# Altium schematic sheet LAUNCHXL-F28379D_5.SchDoc
size 301 x 239 mm
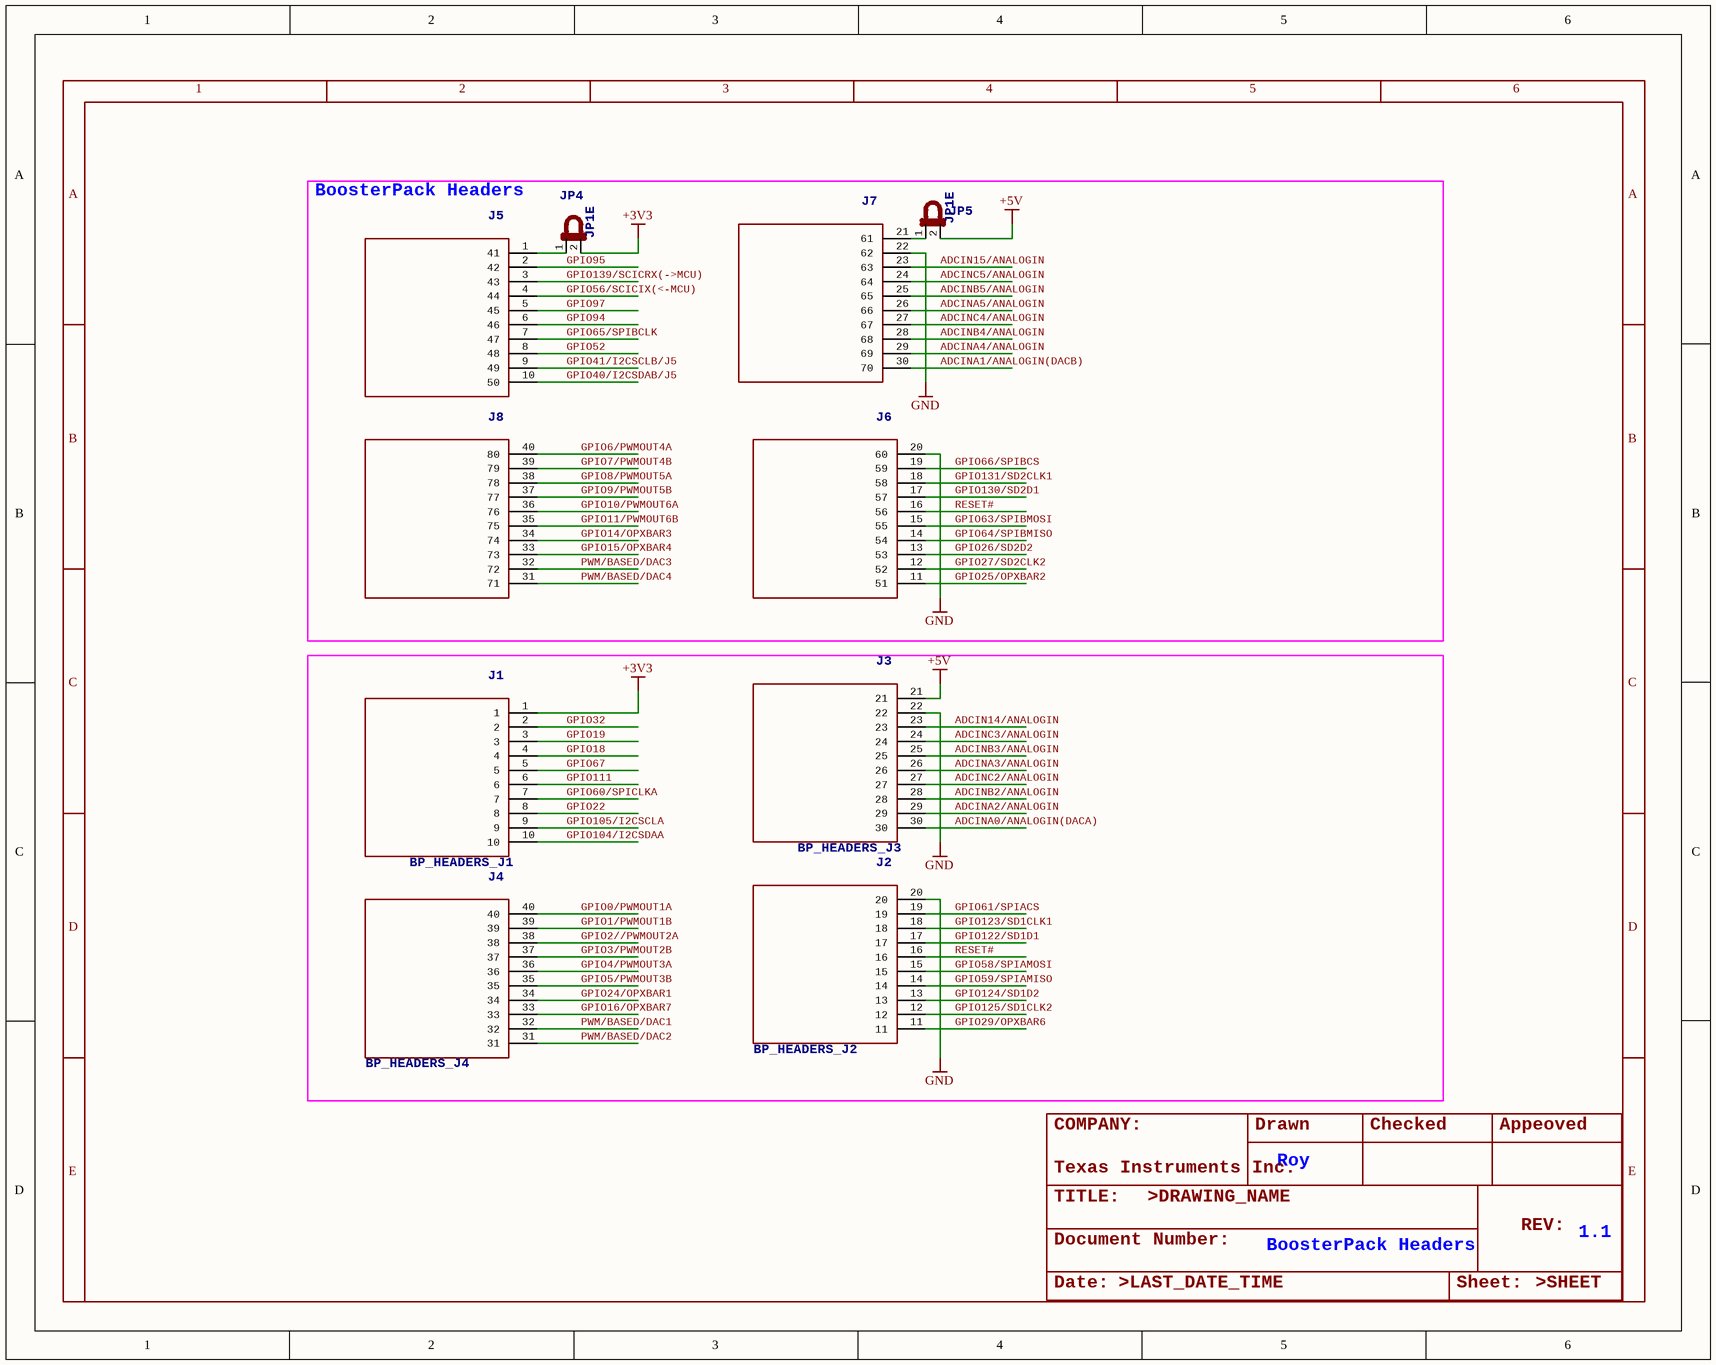
[diagram p0: LAUNCHXL-F28379D_5.SchDoc]

## Parts
J1  BP_HEADERS_J1  [J1]
J2  BP_HEADERS_J2  [J2]
J3  BP_HEADERS_J3  [J3]
J4  BP_HEADERS_J4  [J4]
J5  LAUNCHPAD_TEMPLATE_LIBRARY_BP_HEADERS_J5  [LAUNCHPAD_TEMPLATE_LIBRARY_J5]  (value not drawn)
J6  LAUNCHPAD_TEMPLATE_LIBRARY_BP_HEADERS_J6  [LAUNCHPAD_TEMPLATE_LIBRARY_J6]  (value not drawn)
J7  LAUNCHPAD_TEMPLATE_LIBRARY_BP_HEADERS_J7  [LAUNCHPAD_TEMPLATE_LIBRARY_J7]  (value not drawn)
J8  LAUNCHPAD_TEMPLATE_LIBRARY_BP_HEADERS_J8  [LAUNCHPAD_TEMPLATE_LIBRARY_J8]  (value not drawn)
JP4  JP1E  [JP1]
JP5  JP1E  [JP1]
U$12  ROY_JUMPER  [ROY_JUMPER]  (value not drawn)
U$13  ROY_JUMPER  [ROY_JUMPER]  (value not drawn)

## Blocks framed on the sheet
BoosterPack Headers: J5-J8 JP4 JP5 U$12 U$13

## Nets
+3V3: J1.1 JP4.2
+5V: J3.21 JP5.2
GND: J2.20 J3.22 J6.20(60) J7.22(62)
ADCIN14/ANALOGIN: J3.23
ADCIN15/ANALOGIN: J7.23(63)
ADCINA0/ANALOGIN(DACA): J3.30
ADCINA1/ANALOGIN(DACB): J7.30(70)
ADCINA2/ANALOGIN: J3.29
ADCINA3/ANALOGIN: J3.26
ADCINA4/ANALOGIN: J7.29(69)
ADCINA5/ANALOGIN: J7.26(66)
ADCINB2/ANALOGIN: J3.28
ADCINB3/ANALOGIN: J3.25
ADCINB4/ANALOGIN: J7.28(68)
ADCINB5/ANALOGIN: J7.25(65)
ADCINC2/ANALOGIN: J3.27
ADCINC3/ANALOGIN: J3.24
ADCINC4/ANALOGIN: J7.27(67)
ADCINC5/ANALOGIN: J7.24(64)
GPIO0/PWMOUT1A: J4.40
GPIO1/PWMOUT1B: J4.39
GPIO2//PWMOUT2A: J4.38
GPIO3/PWMOUT2B: J4.37
GPIO4/PWMOUT3A: J4.36
GPIO5/PWMOUT3B: J4.35
GPIO6/PWMOUT4A: J8.40(80)
GPIO7/PWMOUT4B: J8.39(79)
GPIO8/PWMOUT5A: J8.38(78)
GPIO9/PWMOUT5B: J8.37(77)
GPIO10/PWMOUT6A: J8.36(76)
GPIO11/PWMOUT6B: J8.35(75)
GPIO14/OPXBAR3: J8.34(74)
GPIO15/OPXBAR4: J8.33(73)
GPIO16/OPXBAR7: J4.33
GPIO18: J1.4
GPIO19: J1.3
GPIO22: J1.8
GPIO24/OPXBAR1: J4.34
GPIO25/OPXBAR2: J6.11(51)
GPIO26/SD2D2: J6.13(53)
GPIO27/SD2CLK2: J6.12(52)
GPIO29/OPXBAR6: J2.11
GPIO32: J1.2
GPIO40/I2CSDAB/J5: J5.10(50)
GPIO41/I2CSCLB/J5: J5.9(49)
GPIO52: J5.8(48)
GPIO56/SCICIX(<-MCU): J5.4(44)
GPIO58/SPIAMOSI: J2.15
GPIO59/SPIAMISO: J2.14
GPIO60/SPICLKA: J1.7
GPIO61/SPIACS: J2.19
GPIO63/SPIBMOSI: J6.15(55)
GPIO64/SPIBMISO: J6.14(54)
GPIO65/SPIBCLK: J5.7(47)
GPIO66/SPIBCS: J6.19(59)
GPIO67: J1.5
GPIO94: J5.6(46)
GPIO95: J5.2(42)
GPIO97: J5.5(45)
GPIO104/I2CSDAA: J1.10
GPIO105/I2CSCLA: J1.9
GPIO111: J1.6
GPIO122/SD1D1: J2.17
GPIO123/SD1CLK1: J2.18
GPIO124/SD1D2: J2.13
GPIO125/SD1CLK2: J2.12
GPIO130/SD2D1: J6.17(57)
GPIO131/SD2CLK1: J6.18(58)
GPIO139/SCICRX(->MCU): J5.3(43)
PWM/BASED/DAC1: J4.32
PWM/BASED/DAC2: J4.31
PWM/BASED/DAC3: J8.32(72)
PWM/BASED/DAC4: J8.31(71)
RESET#: J2.16 J6.16(56)
NetJ5_1: J5.1(41) JP4.1
NetJ7_21: J7.21(61) JP5.1

## Notes on the sheet
- COMPANY:
- Texas
  Instruments Inc.
- Drawn
- Roy
- Checked
- Appeoved
- TITLE:
- Document Number:
- >DRAWING_NAME
- REV:
- 1.1
- Date:
- >LAST_DATE_TIME
- BoosterPack Headers
- Sheet:
- >SHEET
- 1
- 2
- 3
- 4
- 5
- 6
- A
- B
- C
- D
- E

## Library data of the parts
JP4 JP5 = JP1E: <b>JUMPER</b>